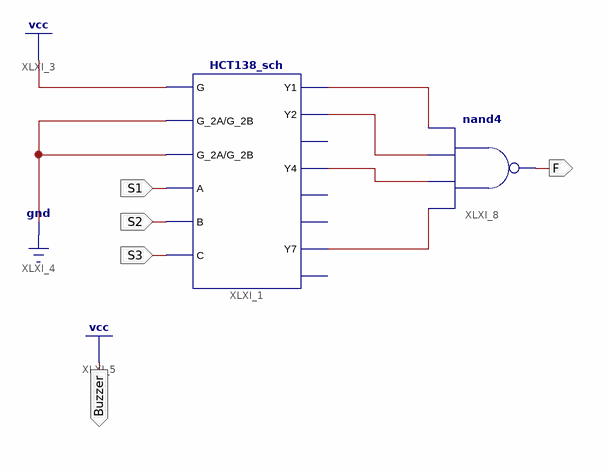
[diagram p0: schematic sheet 1]
// Xilinx ISE schematic Lamp138_sch.sch (kintex7) as structural Verilog: 2 symbols, 5 ports
module Lamp138_sch (
  input  S1,
  input  S2,
  input  S3,
  output Buzzer,
  output F
);

  wire XLXN_19, XLXN_21, XLXN_22, XLXN_23;

  HCT138_sch XLXI_1 (
    .G(1'b1), .G_2A(1'b0), .G_2B(1'b0), .A(S1), .B(S2), .C(S3), .Y1(XLXN_19), .Y2(XLXN_21), .Y4(XLXN_22),
    .Y7(XLXN_23));  // open: Y3, Y5, Y6, Y0
  nand XLXI_8 (F, XLXN_23, XLXN_22, XLXN_21, XLXN_19);

  assign Buzzer = 1'b1;
endmodule
